# Altium schematic sheet BB8_BMS.SchDoc
size B
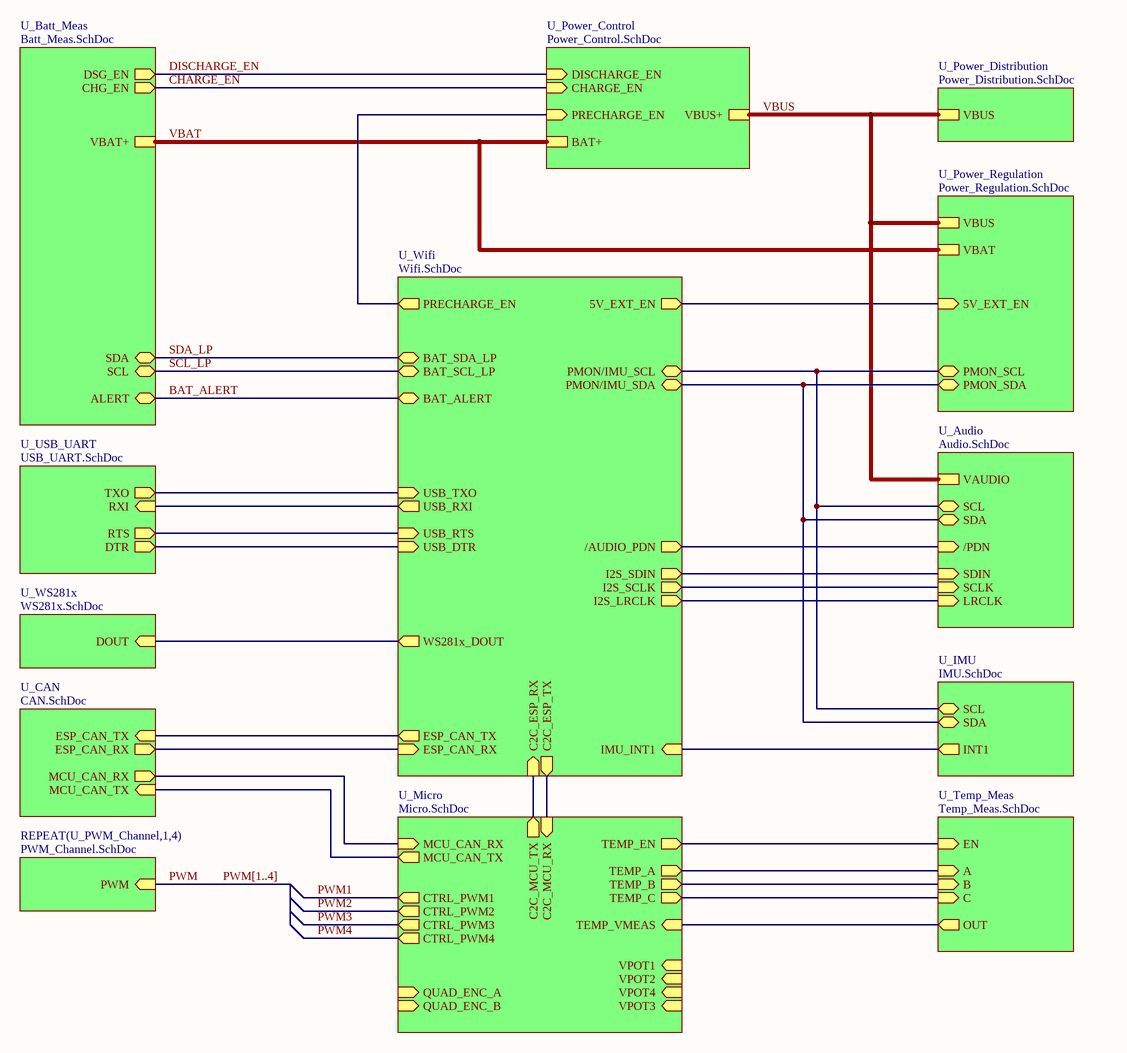
[diagram p0: BB8_BMS.SchDoc]

## Sub-sheets
REPEAT(U_PWM_Channel,1,4) = PWM_Channel.SchDoc: PWM (in)
U_Audio = Audio.SchDoc: VAUDIO, /PDN (in), SDA (bidir), SCL (bidir), SDIN (in), SCLK (in), LRCLK (in)
U_Batt_Meas = Batt_Meas.SchDoc: SCL (bidir), SDA (bidir), VBAT+, CHG_EN (out), DSG_EN (out), ALERT (bidir)
U_CAN = CAN.SchDoc: MCU_CAN_RX (out), MCU_CAN_TX (in), ESP_CAN_TX (in), ESP_CAN_RX (out)
U_IMU = IMU.SchDoc: INT1 (out), SDA (bidir), SCL (bidir)
U_Micro = Micro.SchDoc: TEMP_A (out), TEMP_B (out), TEMP_VMEAS (in), TEMP_C (out), TEMP_EN (out), CTRL_PWM1 (out), CTRL_PWM2 (out), CTRL_PWM3 (out), CTRL_PWM4 (out), C2C_MCU_TX (out), C2C_MCU_RX (in), MCU_CAN_RX (in), MCU_CAN_TX (out), VPOT3 (in), VPOT1 (in), QUAD_ENC_A (in), VPOT4 (in), QUAD_ENC_B (in), VPOT2 (in)
U_Power_Control = Power_Control.SchDoc: BAT+, VBUS+, DISCHARGE_EN (in), CHARGE_EN (in), PRECHARGE_EN (in)
U_Power_Distribution = Power_Distribution.SchDoc: VBUS
U_Power_Regulation = Power_Regulation.SchDoc: VBUS, VBAT, 5V_EXT_EN (in), PMON_SCL (bidir), PMON_SDA (bidir)
U_Temp_Meas = Temp_Meas.SchDoc: A (in), B (in), OUT (out), C (in), EN (in)
U_USB_UART = USB_UART.SchDoc: RXI (in), TXO (out), RTS (out), DTR (out)
U_Wifi = Wifi.SchDoc: USB_TXO (in), USB_RXI (out), USB_RTS (in), USB_DTR (in), IMU_INT1 (in), BAT_ALERT (bidir), BAT_SCL_LP (bidir), BAT_SDA_LP (bidir), 5V_EXT_EN (out), PMON/IMU_SCL (bidir), PMON/IMU_SDA (bidir), PRECHARGE_EN (out), ESP_CAN_TX (out), ESP_CAN_RX (in), /AUDIO_PDN (out), I2S_SDIN (out), I2S_SCLK (out), I2S_LRCLK (out), WS281x_DOUT (out), C2C_ESP_RX (in), C2C_ESP_TX (out)
U_WS281x = WS281x.SchDoc: DOUT (in)

## Nets
BAT_ALERT: sheet U_Batt_Meas/ALERT, sheet U_Wifi/BAT_ALERT
CHARGE_EN: sheet U_Batt_Meas/CHG_EN, sheet U_Power_Control/CHARGE_EN
DISCHARGE_EN: sheet U_Batt_Meas/DSG_EN, sheet U_Power_Control/DISCHARGE_EN
PWM: sheet REPEAT(U_PWM_Channel,1,4)/PWM
PWM1: sheet U_Micro/CTRL_PWM1
PWM2: sheet U_Micro/CTRL_PWM2
PWM3: sheet U_Micro/CTRL_PWM3
PWM4: sheet U_Micro/CTRL_PWM4
SCL_LP: sheet U_Batt_Meas/SCL, sheet U_Wifi/BAT_SCL_LP
SDA_LP: sheet U_Batt_Meas/SDA, sheet U_Wifi/BAT_SDA_LP
VBAT: sheet U_Batt_Meas/VBAT+, sheet U_Power_Control/BAT+, sheet U_Power_Regulation/VBAT
VBUS: sheet U_Power_Control/VBUS+, sheet U_Power_Distribution/VBUS, sheet U_Power_Regulation/VBUS, sheet U_Audio/VAUDIO
(unnamed): sheet U_Power_Control/PRECHARGE_EN, sheet U_Wifi/PRECHARGE_EN
(unnamed): sheet U_Wifi/USB_TXO, sheet U_USB_UART/TXO
(unnamed): sheet U_Wifi/USB_RXI, sheet U_USB_UART/RXI
(unnamed): sheet U_Wifi/USB_RTS, sheet U_USB_UART/RTS
(unnamed): sheet U_Wifi/USB_DTR, sheet U_USB_UART/DTR
(unnamed): sheet U_Wifi/IMU_INT1, sheet U_IMU/INT1
(unnamed): sheet U_Wifi/5V_EXT_EN, sheet U_Power_Regulation/5V_EXT_EN
(unnamed): sheet U_Wifi/PMON/IMU_SCL, sheet U_Power_Regulation/PMON_SCL, sheet U_IMU/SCL, sheet U_Audio/SCL
(unnamed): sheet U_Wifi/PMON/IMU_SDA, sheet U_Power_Regulation/PMON_SDA, sheet U_IMU/SDA, sheet U_Audio/SDA
(unnamed): sheet U_Wifi/ESP_CAN_TX, sheet U_CAN/ESP_CAN_TX
(unnamed): sheet U_Wifi/ESP_CAN_RX, sheet U_CAN/ESP_CAN_RX
(unnamed): sheet U_Wifi//AUDIO_PDN, sheet U_Audio//PDN
(unnamed): sheet U_Wifi/I2S_SDIN, sheet U_Audio/SDIN
(unnamed): sheet U_Wifi/I2S_SCLK, sheet U_Audio/SCLK
(unnamed): sheet U_Wifi/I2S_LRCLK, sheet U_Audio/LRCLK
(unnamed): sheet U_Wifi/WS281x_DOUT, sheet U_WS281x/DOUT
(unnamed): sheet U_Wifi/C2C_ESP_RX, sheet U_Micro/C2C_MCU_TX
(unnamed): sheet U_Wifi/C2C_ESP_TX, sheet U_Micro/C2C_MCU_RX
(unnamed): sheet U_Temp_Meas/A, sheet U_Micro/TEMP_A
(unnamed): sheet U_Temp_Meas/B, sheet U_Micro/TEMP_B
(unnamed): sheet U_Temp_Meas/OUT, sheet U_Micro/TEMP_VMEAS
(unnamed): sheet U_Temp_Meas/C, sheet U_Micro/TEMP_C
(unnamed): sheet U_Temp_Meas/EN, sheet U_Micro/TEMP_EN
(unnamed): sheet U_CAN/MCU_CAN_RX, sheet U_Micro/MCU_CAN_RX
(unnamed): sheet U_CAN/MCU_CAN_TX, sheet U_Micro/MCU_CAN_TX

## Buses and harness runs
bus PWM[1..4]